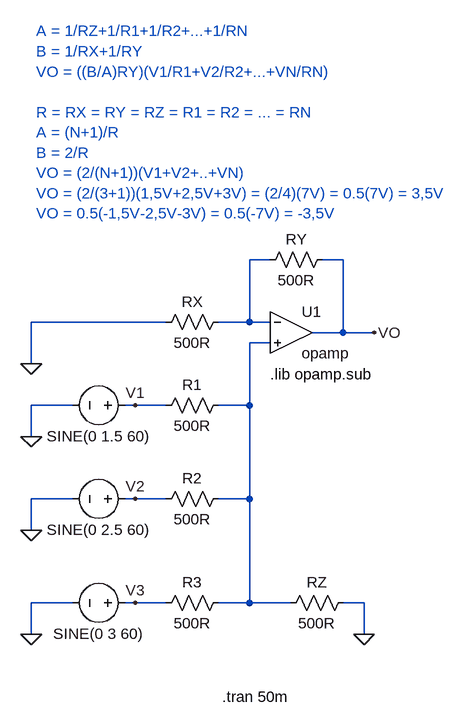
[diagram p0: schematic AMP06 - O Amplificador Somador Não-Inversor.asc]
AMP06 - O Amplificador Somador Não-Inversor.asc, the LTspice schematic file:
Version 4
SHEET 1 880 704
WIRE 144 16 112 16
WIRE 256 16 224 16
WIRE -16 112 -224 112
WIRE 112 112 112 16
WIRE 112 112 64 112
WIRE 144 112 112 112
WIRE 256 128 256 16
WIRE 256 128 208 128
WIRE 304 128 256 128
WIRE 144 144 112 144
WIRE -224 176 -224 112
WIRE -160 240 -224 240
WIRE -64 240 -80 240
WIRE -16 240 -64 240
WIRE 112 240 112 144
WIRE 112 240 64 240
WIRE -224 288 -224 240
WIRE -160 384 -224 384
WIRE -64 384 -80 384
WIRE -16 384 -64 384
WIRE 112 384 112 240
WIRE 112 384 64 384
WIRE -224 432 -224 384
WIRE -160 544 -224 544
WIRE -64 544 -80 544
WIRE -16 544 -64 544
WIRE 112 544 112 384
WIRE 112 544 64 544
WIRE 176 544 112 544
WIRE 288 544 256 544
WIRE -224 592 -224 544
WIRE 288 592 288 544
FLAG 304 128 VO
FLAG -224 288 0
FLAG -224 432 0
FLAG -224 592 0
FLAG -64 240 V1
FLAG -64 384 V2
FLAG -64 544 V3
FLAG -224 176 0
FLAG 288 592 0
SYMBOL Opamps\\opamp 176 64 R0
SYMATTR InstName U1
SYMBOL res 240 0 R90
WINDOW 0 0 56 VBottom 2
WINDOW 3 32 56 VTop 2
SYMATTR InstName RY
SYMATTR Value 500R
SYMBOL voltage -64 240 R90
WINDOW 0 -32 56 Invisible 2
WINDOW 3 32 56 VTop 2
WINDOW 123 0 0 Left 2
WINDOW 39 0 0 Left 2
SYMATTR InstName V1
SYMATTR Value SINE(0 1.5 60)
SYMBOL voltage -64 384 R90
WINDOW 0 -32 56 Invisible 2
WINDOW 3 32 56 VTop 2
WINDOW 123 0 0 Left 2
WINDOW 39 0 0 Left 2
SYMATTR InstName V2
SYMATTR Value SINE(0 2.5 60)
SYMBOL voltage -64 544 R90
WINDOW 0 -32 56 Invisible 2
WINDOW 3 32 56 VTop 2
WINDOW 123 0 0 Left 2
WINDOW 39 0 0 Left 2
SYMATTR InstName V3
SYMATTR Value SINE(0 3 60)
SYMBOL res 80 224 R90
WINDOW 0 0 56 VBottom 2
WINDOW 3 32 56 VTop 2
SYMATTR InstName R1
SYMATTR Value 500R
SYMBOL res 80 368 R90
WINDOW 0 0 56 VBottom 2
WINDOW 3 32 56 VTop 2
SYMATTR InstName R2
SYMATTR Value 500R
SYMBOL res 80 528 R90
WINDOW 0 0 56 VBottom 2
WINDOW 3 32 56 VTop 2
SYMATTR InstName R3
SYMATTR Value 500R
SYMBOL res 80 96 R90
WINDOW 0 0 56 VBottom 2
WINDOW 3 32 56 VTop 2
SYMATTR InstName RX
SYMATTR Value 500R
SYMBOL res 272 528 R90
WINDOW 0 0 56 VBottom 2
WINDOW 3 32 56 VTop 2
SYMATTR InstName RZ
SYMATTR Value 500R
TEXT 144 192 Left 2 !.lib opamp.sub
TEXT -216 -336 Left 2 ;A = 1/RZ+1/R1+1/R2+...+1/RN\nB = 1/RX+1/RY\nVO = ((B/A)RY)(V1/R1+V2/R2+...+VN/RN)\n \nR = RX = RY = RZ = R1 = R2 = ... = RN\nA = (N+1)/R\nB = 2/R\nVO = (2/(N+1))(V1+V2+..+VN)\nVO = (2/(3+1))(1,5V+2,5V+3V) = (2/4)(7V) = 0.5(7V) = 3,5V\nVO = 0.5(-1,5V-2,5V-3V) = 0.5(-7V) = -3,5V
TEXT 70 688 Left 2 !.tran 50m

The netlist it stands for:
* AMP06 - O Amplificador Somador Não-Inversor.asc
XU1 N001 N002 VO opamp Aol=100K GBW=10Meg  ; pins invin noninvin out
RY VO N001 500R
V1 V1 0 SINE(0 1.5 60)
V2 V2 0 SINE(0 2.5 60)
V3 V3 0 SINE(0 3 60)
R1 N002 V1 500R
R2 N002 V2 500R
R3 N002 V3 500R
RX N001 0 500R
RZ 0 N002 500R
.lib opamp.sub
* A = 1/RZ+1/R1+1/R2+...+1/RN
* B = 1/RX+1/RY
* VO = ((B/A)RY)(V1/R1+V2/R2+...+VN/RN)
* R = RX = RY = RZ = R1 = R2 = ... = RN
* A = (N+1)/R
* B = 2/R
* VO = (2/(N+1))(V1+V2+..+VN)
* VO = (2/(3+1))(1,5V+2,5V+3V) = (2/4)(7V) = 0.5(7V) = 3,5V
* VO = 0.5(-1,5V-2,5V-3V) = 0.5(-7V) = -3,5V
.tran 50m
.backanno
.end